# EAGLE design fridge (EAGLE 6.3)
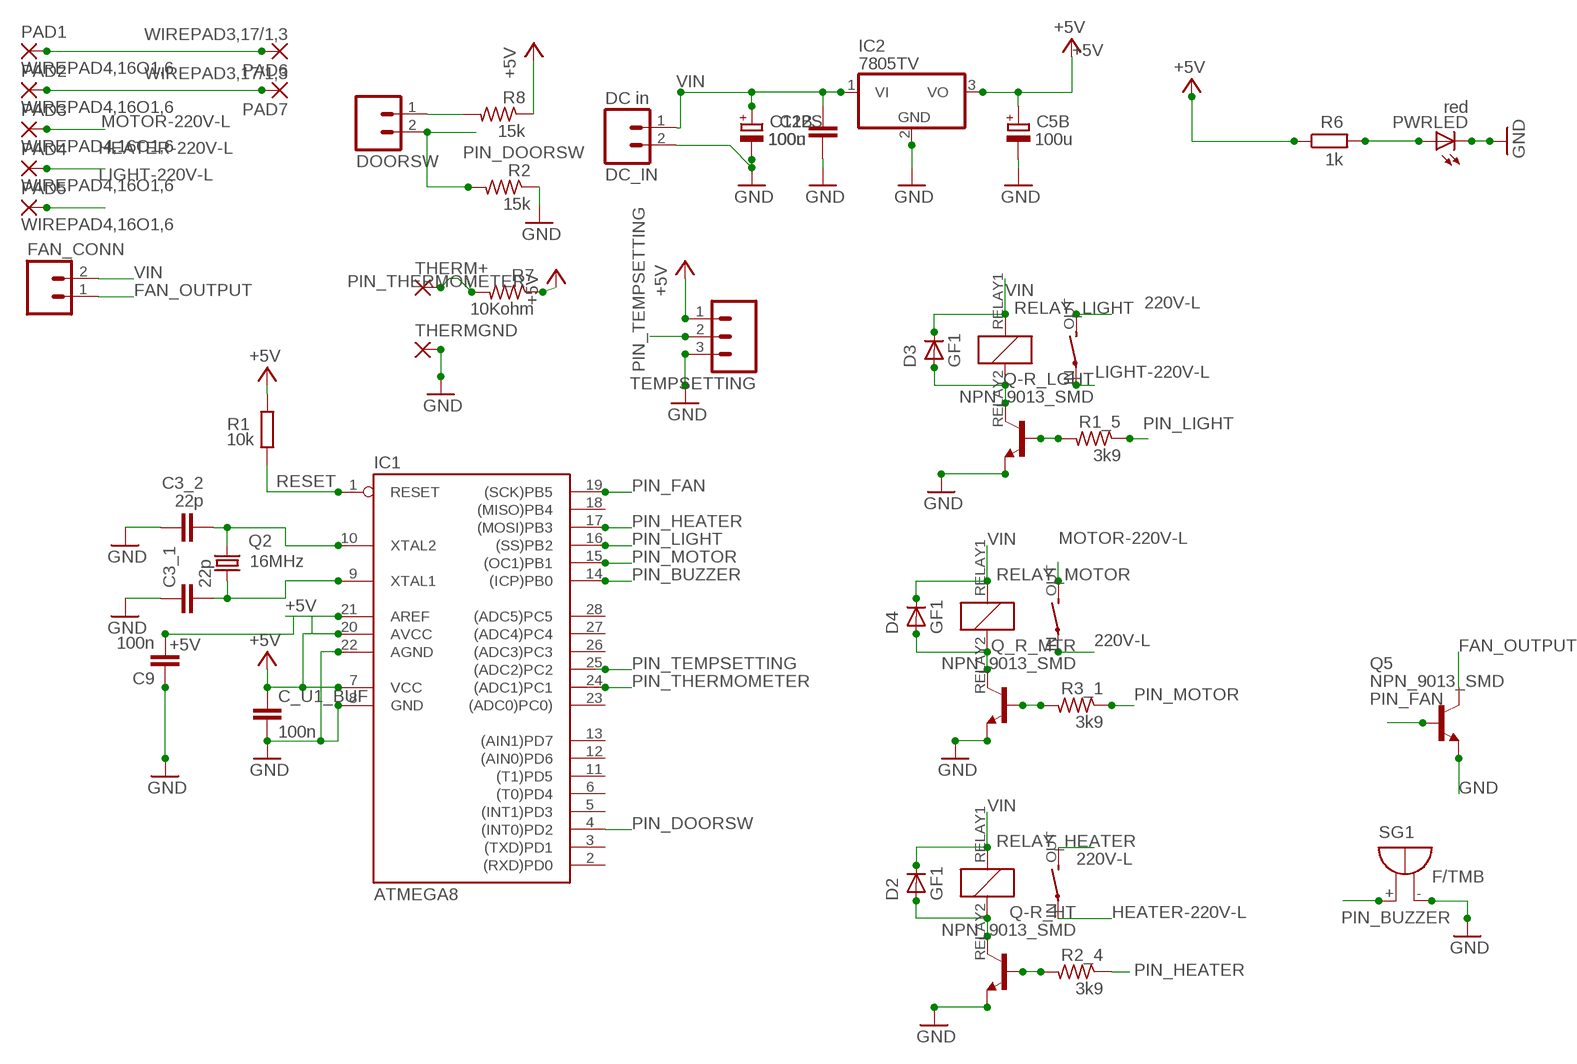
[diagram p0: schematic, sheet 1]

## Parts
C3_1  22p  C-EU025-025X050  [C025-025X050]
C3_2  22p  C-EU025-025X050  [C025-025X050]
C5B  100u  CPOL-EUE2.5-7  [E2,5-7]
C9  100n  C-EU050-030X075  [C050-030X075]
C12B  100u  CPOL-EUE2.5-7  [E2,5-7]
C12S  100n  C-EU050-035X075  [C050-035X075]
C_U1_BUF  100n  C-EU050-035X075  [C050-035X075]
D2  GF1  [SMA-DO214AC]
D3  GF1  [SMA-DO214AC]
D4  GF1  [SMA-DO214AC]
DC_IN  DC in  M02  [02P]
DOORSW  M02  [02P]
FAN_CONN  M02  [02P]
IC1  ATMEGA8  AT90S4433P  [DIL28-3]
IC2  7805TV  [TO220V]
PAD1  WIREPAD4,16O1,6  [4,16O1,6]
PAD2  WIREPAD4,16O1,6  [4,16O1,6]
PAD3  WIREPAD4,16O1,6  [4,16O1,6]
PAD4  WIREPAD4,16O1,6  [4,16O1,6]
PAD5  WIREPAD4,16O1,6  [4,16O1,6]
PAD6  WIREPAD3,17/1,3  [3,17/1,3]
PAD7  WIREPAD3,17/1,3  [3,17/1,3]
PWRLED  red  LED5MM  [LED5MM]
Q2  16MHz  CRYTALHC49S  [HC49/S]
Q5  NPN_9013_SMD  BC337  [TO92]
Q-R_HT  NPN_9013_SMD  BC337  [TO92]
Q-R_LGHT  NPN_9013_SMD  BC337  [TO92]
Q_R_MTR  NPN_9013_SMD  BC337  [TO92]
R1  10k  R-EU_0204/7  [0204/7]
R1_5  3k9  R-US_0204/7  [0204/7]
R2  15k  R-US_0204/2V  [0204V]
R2_4  3k9  R-US_0204/7  [0204/7]
R3_1  3k9  R-US_0204/7  [0204/7]
R6  1k  R-EU_0204/7  [0204/7]
R7  10Kohm  R-US_0204/2V  [0204V]
R8  15k  R-US_0204/2V  [0204V]
RELAY_HEATER  OJE-SS-112HMFSPSTOJE-SS-112HMF  [OJ/OJE_SERIES]
RELAY_LIGHT  OJE-SS-112HMFSPSTOJE-SS-112HMF  [OJ/OJE_SERIES]
RELAY_MOTOR  OJE-SS-112HMFSPSTOJE-SS-112HMF  [OJ/OJE_SERIES]
SG1  F/TMB  [F/TMB]
TEMPSETTING  M03  [03P]
THERM+  1,6/0,9  [1,6/0,9]
THERMGND  1,6/0,9  [1,6/0,9]

## Nets
220V-L [gnd]: PAD1.1(P) PAD6.1(P) RELAY_HEATER.OUT RELAY_LIGHT.OUT RELAY_MOTOR.IN
220V-N: PAD2.1(P) PAD7.1(P)
+5V [gnd]: C5B.+ C9.2 C_U1_BUF.1 IC1.7(VCC) IC1.20(AVCC) IC1.21(AREF) IC2.3(VO) R1.2 R6.1 R7.1 R8.1 TEMPSETTING.1
FAN_OUTPUT [gnd]: FAN_CONN.1 Q5.3(C)
GND [gnd]: C3_1.1 C3_2.1 C5B.- C9.1 C12B.- C12S.1 C_U1_BUF.2 DC_IN.2 IC1.8(GND) IC1.22(AGND) IC2.2(GND) PWRLED.K(C) Q5.1(E) Q-R_HT.1(E) Q-R_LGHT.1(E) Q_R_MTR.1(E) R2.1 SG1.- TEMPSETTING.3 THERMGND.1(P)
HEATER-220V-L: PAD4.1(P) RELAY_HEATER.IN
LIGHT-220V-L: PAD5.1(P) RELAY_LIGHT.IN
MOTOR-220V-L: PAD3.1(P) RELAY_MOTOR.OUT
N$1: DOORSW.1 R8.2
N$2: Q-R_HT.2(B) R2_4.2
N$3: PWRLED.A R6.2
N$4: D2.A Q-R_HT.3(C) RELAY_HEATER.RELAY2(RELAY_2)
N$5: Q-R_LGHT.2(B) R1_5.2
N$6: C3_1.2 IC1.9(XTAL1) Q2.1
N$7: C3_2.2 IC1.10(XTAL2) Q2.2
N$9: D4.A Q_R_MTR.3(C) RELAY_MOTOR.RELAY2(RELAY_2)
N$11: Q_R_MTR.2(B) R3_1.2
N$14: D3.A Q-R_LGHT.3(C) RELAY_LIGHT.RELAY2(RELAY_2)
PIN_BUZZER [gnd]: IC1.14((ICP)PB0) SG1.+
PIN_DOORSW: DOORSW.2 IC1.4((INT0)PD2) R2.2
PIN_FAN [gnd]: IC1.19((SCK)PB5) Q5.2(B)
PIN_HEATER: IC1.17((MOSI)PB3) R2_4.1
PIN_LIGHT: IC1.16((SS)PB2) R1_5.1
PIN_MOTOR [gnd]: IC1.15((OC1)PB1) R3_1.1
PIN_TEMPSETTING: IC1.25((ADC2)PC2) TEMPSETTING.2
PIN_THERMOMETER: IC1.24((ADC1)PC1) R7.2 THERM+.1(P)
RESET: IC1.1(RESET) R1.1
VIN [power]: C12B.+ C12S.2 D2.K(C) D3.K(C) D4.K(C) DC_IN.1 FAN_CONN.2 IC2.1(VI) RELAY_HEATER.RELAY1(RELAY_1) RELAY_LIGHT.RELAY1(RELAY_1) RELAY_MOTOR.RELAY1(RELAY_1)
Unconnected: IC1.2((RXD)PD0) IC1.3((TXD)PD1) IC1.5((INT1)PD3) IC1.6((T0)PD4) IC1.11((T1)PD5) IC1.12((AIN0)PD6) IC1.13((AIN1)PD7) IC1.18((MISO)PB4) IC1.23((ADC0)PC0)) IC1.26((ADC3)PC3) IC1.27((ADC4)PC4) IC1.28((ADC5)PC5)

## Library data of the parts
C3_1 C3_2 C9 C12S C_U1_BUF = rcl:C-EU: CAPACITOR, European symbol
C5B C12B = rcl:CPOL-EU: POLARIZED CAPACITOR, European symbol
D2-D4 = diode:GF1: DIODE
DC_IN DOORSW FAN_CONN = con-amp-quick:M02: AMP QUICK CONNECTOR; OC_FARNELL: unknown; OC_NEWARK: unknown
IC1 = atmel:AT90S4433: MICROCONTROLLER 4 Kbytes FLASH 128 bytes SRAM 256 bytes EEPROM UART 6-channel 10 bit ADC; OC_FARNELL: unknown; OC_NEWARK: unknown
IC2 = linear:78*: Positive VOLTAGE REGULATOR Source: http://cache.national.com/ds/LM/LM78L05.pdf http://www.fairchildsemi.com/ds/LM/LM7805.pdf
PAD1-PAD7 = wirepad:WIREPAD: Wire PAD connect wire on PCB
PWRLED = led:LED: LED OSRAM: - CHIPLED LG R971, LG N971, LY N971, LG Q971, LY Q971, LO R971, LY R971 LH N974, LH R974 LS Q976, LO Q976, LY Q976 LO Q996 - Hyper CHIPLED LW Q18S LB Q993, LB Q99A, LB R99A - SideLED LS A670, LO A670, LY A670, LG A670, LP A670 LB A673, LV A673, LT A673, LW A673 LH A674 LY A675 LS A676, LA A676, LO A676, LY A676, LW A676 LS A679, LY A679, LG A679 - Hyper Micro SIDELED® LS Y876, LA Y876, LO Y876, LY Y876 LT Y87S - SmartLED LW L88C, LW L88S LB L89C, LB L89S, LG L890 LS L89K, LO L89K, LY L89K LS L896, LA L896, LO L896, LY L896 - TOPLED LS T670, LO T670, LY T670, LG T670, LP T670 LSG T670, LSP T670, LSY T670, LOP T670, LYG T670 LG T671, LOG T671, LSG T671 LB T673, LV T673, LT T673, LW T673 LH T674 LS T676, LA T676, LO T676, LY T676, LB T676, LH T676, LSB T676, LW T676 LB T67C, LV T67C, LT T67C, LS T67K, LO T67K, LY T67K, LW E67C LS E67B, LA E67B, LO E67B, LY E67B, LB E67C, LV E67C, LT E67C LW T67C LS T679, LY T679, LG T679 LS T770, LO T770, LY T770, LG T770, LP T770 LB T773, LV T773, LT T773, LW T773 LH T774 LS E675, LA E675, LY E675, LS T675 LS T776, LA T776, LO T776, LY T776, LB T776 LHGB T686 LT T68C, LB T68C - Hyper Mini TOPLED® LB M676 - Mini TOPLED Santana® LG M470 LS M47K, LO M47K, LY M47K Source: http://www.osram.convergy.de LUXEON: - LUMILED® LXK2-PW12-R00, LXK2-PW12-S00, LXK2-PW14-U00, LXK2-PW14-V00 LXK2-PM12-R00, LXK2-PM12-S00, LXK2-PM14-U00 LXK2-PE12-Q00, LXK2-PE12-R00, LXK2-PE12-S00, LXK2-PE14-T00, LXK2-PE14-U00 LXK2-PB12-K00, LXK2-PB12-L00, LXK2-PB12-M00, LXK2-PB14-N00, LXK2-PB14-P00, LXK2-PB14-Q00 LXK2-PR12-L00, LXK2-PR12-M00, LXK2-PR14-Q00, LXK2-PR14-R00 LXK2-PD12-Q00, LXK2-PD12-R00, LXK2-PD12-S00 LXK2-PH12-R00, LXK2-PH12-S00 LXK2-PL12-P00, LXK2-PL12-Q00, LXK2-PL12-R00 Source: www.luxeon.com KINGBRIGHT: KA-3528ASYC Source: www.kingbright.com
Q2 = crystal:CRYTAL: CRYSTAL
Q5 = transistor:BC337: NPN TRANSISTOR
Q-R_HT Q-R_LGHT Q_R_MTR = transistor-neu-to92:BC337: NPN TRANSISTOR
R1 R6 = rcl:R-EU_: RESISTOR, European symbol
R1_5 R2 R2_4 R3_1 R7 R8 = resistor:R-US_: RESISTOR, American symbol
RELAY_HEATER RELAY_LIGHT RELAY_MOTOR = shrack_tyco:OJE-SS-112HMF: 10 A
SG1 = buzzer:F/TMB: BUZZER Source: Buerklin; OC_FARNELL: unknown; OC_NEWARK: unknown
TEMPSETTING = con-amp-quick:M03: AMP QUICK CONNECTOR; OC_FARNELL: unknown; OC_NEWARK: unknown
THERM+ THERMGND = wirepad:1,6/0,9: THROUGH-HOLE PAD

## Net classes
0 default: width 0.152 mm, drill 0.305 mm, clearance 0.152 mm
1 power: width 0.61 mm, drill 0.508 mm, clearance 0.152 mm
2 gnd: width 0.305 mm, drill 0.508 mm, clearance 0.152 mm
3 usbvcc: width 0.508 mm, drill 0.508 mm, clearance 0.152 mm
4 aref: width 0.406 mm

## Board
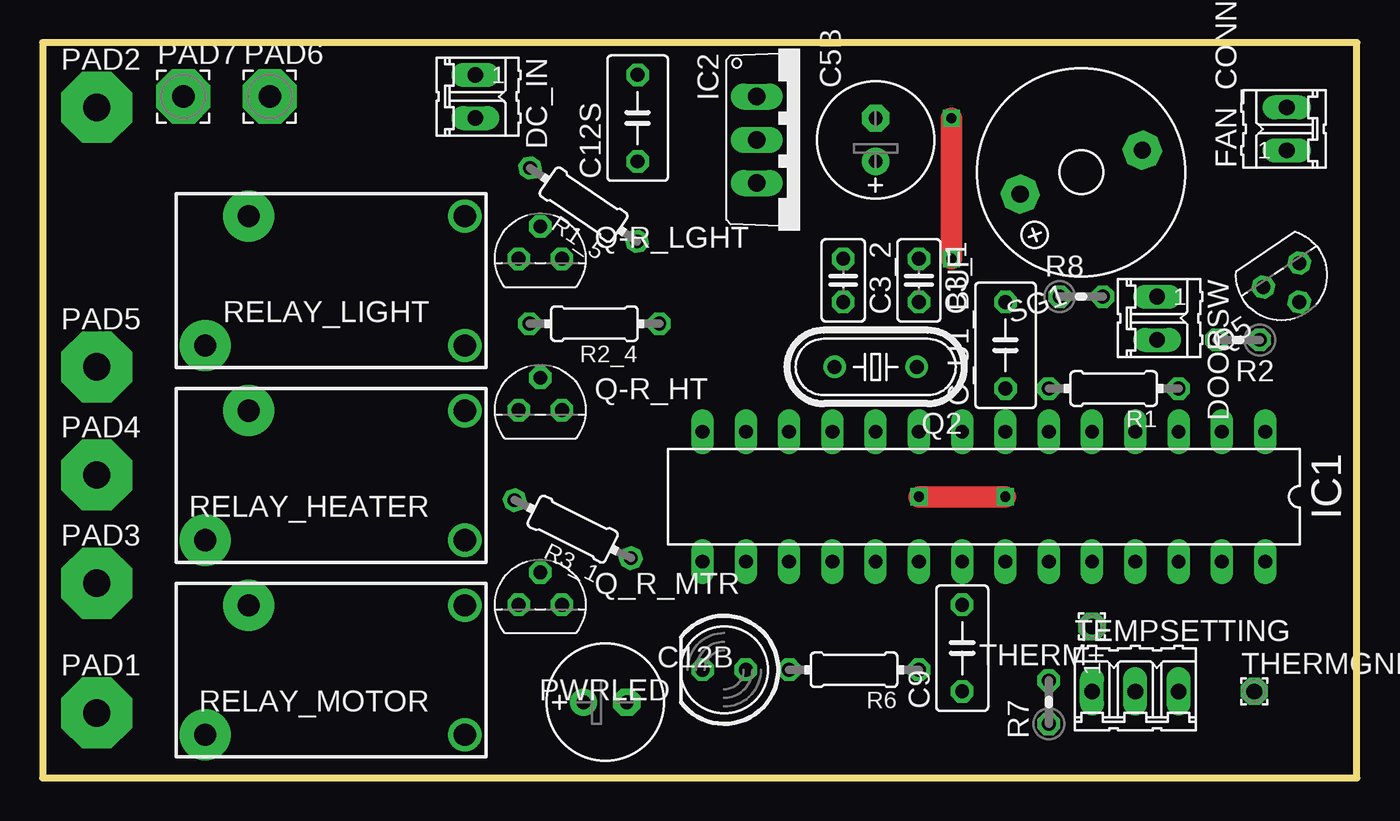
[diagram p1: board, top side]
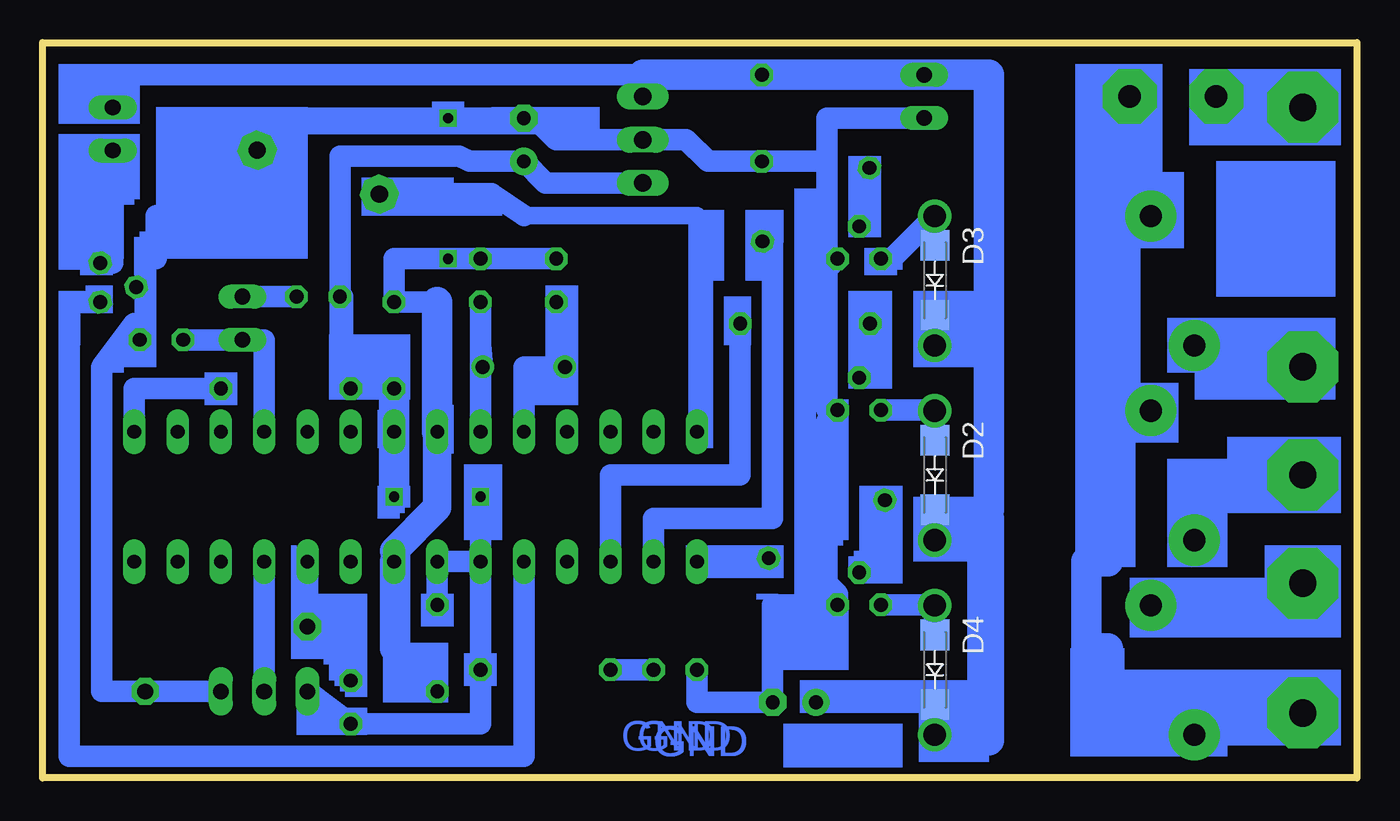
[diagram p2: board, bottom side, seen from below]

Size 77.14 x 43.17 mm. Coordinates in mm from the lower left corner, seen from the top.
Outline: 0,0 77.14,0 77.14,43.17 0,43.17 0,0
Copper layers (1*16): Top 0mil / dielectric 1.5mm / Bottom 0.035mm
Design rules "default *": minimum track width 20mil, minimum drill 1.5mm, track to track 8mil, track to pad 8mil, pad to pad 8mil, via to via 8mil, smd to smd 8mil, copper to edge 40mil, drill to drill 8mil, minimum pad ring 10mil, minimum via ring 8mil, stop-mask expansion 4mil, vias tented up to drill 0mil, thermal gap 10mil

### Footprints (pad centres in the part's own frame; a part is rotated, then mirrored left to right if it is on the bottom)
C025-025X050 = drill 0.813 octagon: 1 -1.27,0; 2 1.27,0
E2,5-7 = drill 0.813 pad 1.6: + -1.27,0 | drill 0.813 pad 1.6 octagon: - 1.27,0
C050-030X075 = drill 0.813 octagon: 1 -2.54,0; 2 2.54,0
C050-035X075 = drill 0.813 octagon: 1 -2.54,0; 2 2.54,0
SMA-DO214AC = smd 1.8 x 1.7: A -2.05,0; K 2.05,0
02P = drill 0.914 long: 1 -1.27,0; 2 1.27,0
DIL28-3 = drill 0.813 long: 1 -16.51,-3.81; 2 -13.97,-3.81; 3 -11.43,-3.81; 4 -8.89,-3.81; 5 -6.35,-3.81; 6 -3.81,-3.81; 7 -1.27,-3.81; 8 1.27,-3.81; 9 3.81,-3.81; 10 6.35,-3.81; 11 8.89,-3.81; 12 11.43,-3.81; 13 13.97,-3.81; 14 16.51,-3.81; 15 16.51,3.81; 16 13.97,3.81; 17 11.43,3.81; 18 8.89,3.81; 19 6.35,3.81; 20 3.81,3.81; 21 1.27,3.81; 22 -1.27,3.81; 23 -3.81,3.81; 24 -6.35,3.81; 25 -8.89,3.81; 26 -11.43,3.81; 27 -13.97,3.81; 28 -16.51,3.81
TO220V = drill 1.016 long: 1 -2.54,-2.54; 2 0,-2.54; 3 2.54,-2.54
4,16O1,6 = drill 1.6 pad 4.166 octagon: 1 0,0
3,17/1,3 = drill 1.321 pad 3.175 octagon: 1 0,0
LED5MM = drill 0.813 octagon: A -1.27,0; K 1.27,0
HC49/S = drill 0.813: 1 -2.413,0; 2 2.413,0
TO92 = drill 0.813 octagon: 1 1.27,0; 2 0,1.905; 3 -1.27,0
0204/7 = drill 0.813 octagon: 1 -3.81,0; 2 3.81,0
0204V = drill 0.813 octagon: 1 -1.27,0; 2 1.27,0
OJ/OJE_SERIES = drill 1.3 pad 3: IN 16.49,8.9; OUT 13.95,1.3 | drill 1.3: RELAY1 1.25,8.9; RELAY2 1.25,1.3
F/TMB = drill 1.016 pad 2.159 octagon: + 3.81,0; - -3.81,0
03P = drill 0.914 long: 1 -2.54,0; 2 0,0; 3 2.54,0
1,6/0,9 = drill 0.914 pad 1.6 octagon: 1 0,0

### Placement (x,y rotation side)
C3_1  51.44,29.21 270 top
C3_2  46.99,29.21 270 top
C5B  48.89,37.47 90 top
C9  53.97,7.62 90 top
C12B  33.02,4.45 0 top
C12S  34.92,38.74 90 top
C_U1_BUF  56.52,25.4 90 top
D2  24.77,17.78 270 bottom
D3  24.77,29.21 270 bottom
D4  24.77,6.35 270 bottom
DC_IN  25.4,40.01 270 top
DOORSW  65.41,26.99 270 top
FAN_CONN  73.02,38.1 90 top
IC1  55.25,16.51 180 top
IC2  44.45,37.47 270 top
PAD1  3.18,3.81 0 top
PAD2  3.18,39.37 0 top
PAD3  3.18,11.43 0 top
PAD4  3.18,17.78 0 top
PAD5  3.18,24.13 0 top
PAD6  13.34,40.01 0 top
PAD7  8.26,40.01 0 top
PWRLED  40,6.35 180 top
Q2  48.89,24.13 180 top
Q5  72.71,29.53 213.7 top
Q-R_HT  29.21,21.59 0 top
Q-R_LGHT  29.21,30.48 0 top
Q_R_MTR  29.21,10.16 0 top
R1  62.86,22.86 180 top
R1_5  31.75,33.66 145.5 top
R2  70.17,25.72 180 top
R2_4  32.39,26.67 180 top
R3_1  31.11,14.61 153.5 top
R6  47.62,6.35 180 top
R7  59.05,4.45 90 top
R8  60.96,28.26 0 top
RELAY_HEATER  26.04,22.86 180 top
RELAY_LIGHT  26.04,34.29 180 top
RELAY_MOTOR  26.04,11.43 180 top
SG1  60.96,35.56 199.8 top
TEMPSETTING  64.13,5.08 0 top
THERM+  61.59,8.89 180 top
THERMGND  71.12,5.08 0 top

### Tracks (layer width: path | path; a pad name or v marks a point on that pad's centre or on a via)
220V-L
  Bottom 1.778: PAD1.1 9.53,3.81 | 9.53,3.81 9.54,3.81 | 9.54,3.81 RELAY_MOTOR.IN 9.53,2.53 9.53,3.81 | 9.54,3.81 14.61,3.81 14.61,7.62 15.88,7.62 15.88,12.7 14.61,12.7 14.61,21.56 | 14.61,21.59 12.09,21.59 RELAY_HEATER.OUT 14.61,21.56 | 14.61,21.56 14.61,21.59 | 14.61,21.59 14.61,32.99 | 14.61,33.02 12.09,33.02 RELAY_LIGHT.OUT 14.61,32.99 | 14.61,32.99 14.61,33.02 | 14.61,33.02 14.61,39.37 13.34,39.37 PAD6.1
220V-N
  Bottom 2.54: PAD2.1 7.62,39.37 PAD7.1
+5V  (via drill 0.6)
  Top 1.27: v56.52,16.51 v51.44,16.51
  Bottom 1.27: IC1.20 R6.1 51.44,3.17 R7.1 TEMPSETTING.1 | C_U1_BUF.1 R1.2 59.53,23.34 | v51.44,16.51 IC1.20 | IC2.3 47.62,34.93 C5B.+ 52.07,36.2 52.7,36.51 59.69,36.51 R8.1 | R8.1 59.69,23.5 59.53,23.34 | IC1.20 IC1.21 C9.2 | R8.1 59.53,28.26 59.53,23.34
  Bottom 1.778: C_U1_BUF.1 IC1.7 v56.52,16.51
FAN_OUTPUT
  Bottom 1.27: FAN_CONN.1 73.02,30.23 Q5.3
GND  (via drill 0.6)
  Top 1.27: v53.34,38.74 v53.34,30.48
  Bottom 0.508: IC1.22 56.52,13.33 56.52,13.97 | 53.97,21.59 IC1.8
  Bottom 1.27: THERMGND.1 TEMPSETTING.3 73.66,5.08 73.66,24.13 71.75,26.67 | C3_2.1 C3_1.1 | 53.97,27.94 C_U1_BUF.2 56.52,30.48 v53.34,30.48 C3_1.1 | PWRLED.K 38.73,4.45 C12B.- 34.29,10.16 Q_R_MTR.1 30.48,10.79 31.11,11.43 31.11,20.95 Q-R_HT.1 31.11,21.59 31.11,29.84 Q-R_LGHT.1 31.11,30.48 31.11,36.2 | 56.52,7.62 C9.1 | SG1.- 65.38,36.85 | C3_1.1 48.89,30.48 | SG1.- 62.66,38.74 v53.34,38.74 C5B.- 48.26,38.74 46.99,37.47 IC2.2 39.37,37.47 38.1,36.2 C12S.1 31.11,36.2 | 31.11,36.2 31.11,38.74 DC_IN.2 | 71.12,28.82 71.12,30.48 70.48,30.48 70.48,33.02 64.55,33.02 SG1.- | 71.12,28.82 71.12,26.67 71.75,26.67 | Q5.1 71.12,28.82 | R2.1 71.75,25.72 71.75,26.67
  Bottom 1.676: IC1.8 53.97,15.88 56.52,13.33 | IC1.22 56.52,7.62
  Bottom 1.778: 53.97,27.94 IC1.8
HEATER-220V-L
  Bottom 1.778: RELAY_HEATER.IN 9.53,13.96 9.53,17.78 PAD4.1
LIGHT-220V-L
  Bottom 1.422: PAD5.1 2,24.13
  Bottom 1.778: RELAY_LIGHT.IN 3.18,25.39 | 3.18,25.39 3.18,25.4 | 3.18,25.39 PAD5.1
MOTOR-220V-L
  Bottom 1.778: RELAY_MOTOR.OUT 3.18,10.13 PAD3.1
N$1
  Bottom 1.27: R8.2 DOORSW.1
N$2
  Bottom 1.27: R2_4.2 28.57,24.13 Q-R_HT.2
N$3
  Bottom 1.27: PWRLED.A R6.2
N$4
  Bottom 0.508: 24.77,21.59 D2.A
  Bottom 0.813: 24.77,21.59 RELAY_HEATER.RELAY2
  Bottom 1.27: Q-R_HT.3 24.82,21.59 RELAY_HEATER.RELAY2
N$5
  Bottom 1.27: R1_5.2 28.61,32.98 Q-R_LGHT.2
N$6
  Bottom 1.27: IC1.9 51.44,25.4 | 51.44,25.4 Q2.1 | C3_1.2 51.44,25.4
N$7
  Bottom 1.27: IC1.10 48.89,24.13 Q2.2 46.99,24.64 C3_2.2
N$9
  Bottom 1.27: 24.77,8.89 D4.A 24.79,8.4 RELAY_MOTOR.RELAY2 24.82,10.16 Q_R_MTR.3
N$11
  Bottom 1.27: R3_1.2 27.71,13.57 Q_R_MTR.2
N$14
  Bottom 1.27: Q-R_LGHT.3 27.29,30.48 RELAY_LIGHT.RELAY2 24.79,31.28 D3.A
PIN_BUZZER
  Bottom 1.016: IC1.14 38.73,33.02 48.89,33.02
  Bottom 1.27: 48.89,33.02 50.8,34.29 53.85,34.29 SG1.+
PIN_DOORSW
  Bottom 1.27: IC1.4 64.13,25.72 DOORSW.2 R2.2
PIN_FAN
  Bottom 1.27: IC1.19 48.89,1.27 75.56,1.27 75.56,27.94 Q5.2
PIN_HEATER
  Bottom 1.27: IC1.17 43.81,17.78 36.19,17.78 R2_4.1
PIN_LIGHT
  Bottom 1.27: IC1.16 41.28,15.24 34.29,15.24 34.29,31.43 R1_5.1
PIN_MOTOR
  Bottom 1.27: IC1.15 34.53,12.7 R3_1.1
PIN_TEMPSETTING
  Bottom 1.27: IC1.25 TEMPSETTING.2
PIN_THERMOMETER
  Bottom 1.27: IC1.24 THERM+.1 59.05,8.89 R7.2
RESET
  Bottom 1.27: R1.1 71.75,22.86 IC1.1
VIN
  Bottom 0.61: 24.77,25.4 RELAY_LIGHT.RELAY1
  Bottom 0.813: D2.K 24.77,15.24 24.77,13.97 RELAY_HEATER.RELAY1 | RELAY_MOTOR.RELAY1 24.77,2.53 24.77,2.54 D4.K
  Bottom 1.27: 24.77,2.54 21.59,2.22 | 24.77,15.24 21.59,15.24 21.59,15.73 D2.K | 24.77,26.67 21.59,26.99 21.59,27.16 D3.K | 24.77,26.67 D3.K | D3.K 24.77,27.94 | FAN_CONN.2 73.02,41.28 41.91,41.28 IC2.1 | C12B.+ 24.91,4.45 D4.K | 24.77,25.4 24.77,26.67
  Bottom 1.778: 21.59,2.22 21.59,15.24 | 21.59,15.73 21.59,26.99 | 21.59,27.16 21.59,41.28 DC_IN.1 C12S.2 41.91,41.28
(copper drawn outside any net)
  shapes: Bottom area x136

### Text on the board
Bottom: GND | GND | GND | GND | GND | GND | GND | GND | GND | GND | GND | GND | GND